# EAGLE design Water Auto Turret Main Board (EAGLE 9.6.2)
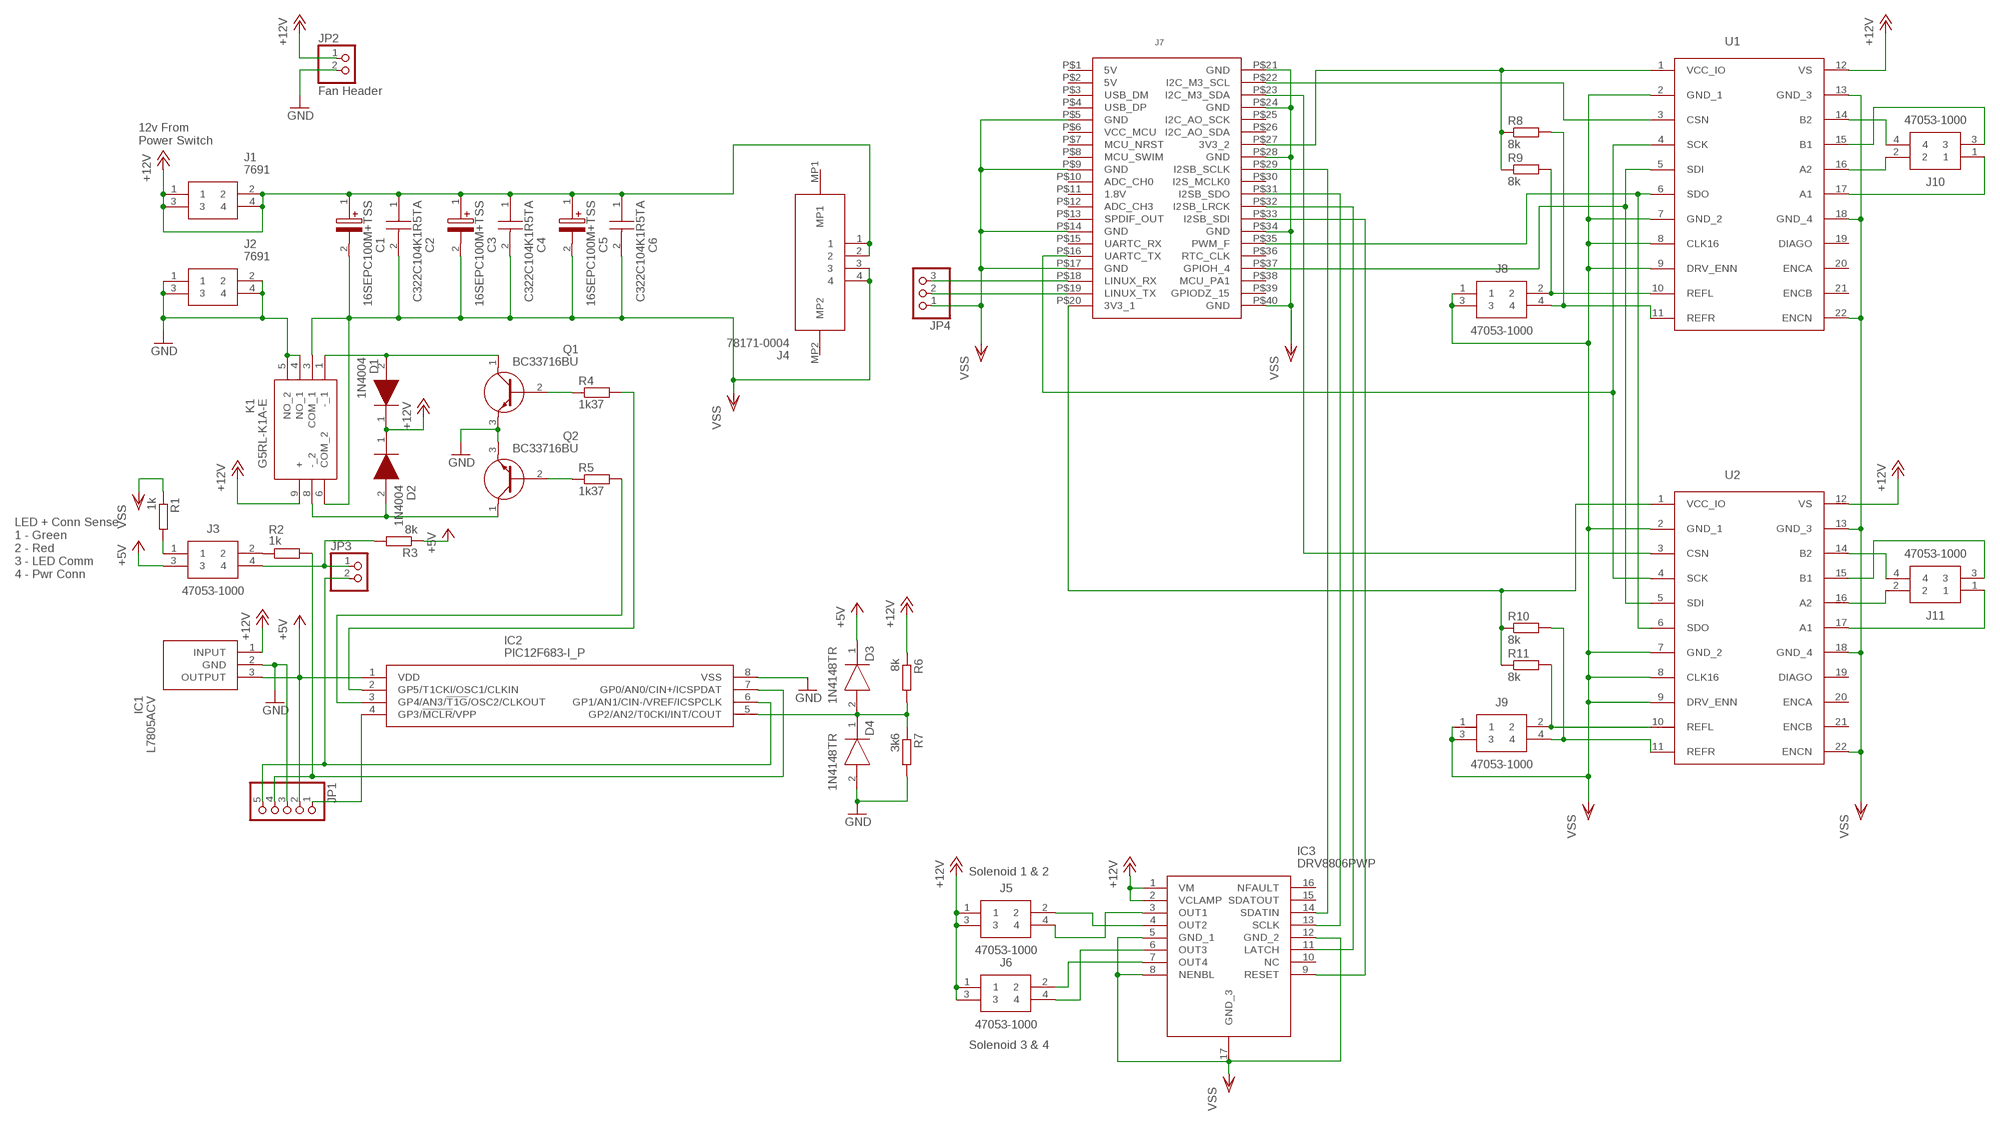
[diagram p0: schematic, sheet 1]

## Parts
C1  16SEPC100M+TSS  [CAPPRD250W45D630H600]
C2  C322C104K1R5TA  [C322C104K1R5TA]
C3  16SEPC100M+TSS  [CAPPRD250W45D630H600]
C4  C322C104K1R5TA  [C322C104K1R5TA]
C5  16SEPC100M+TSS  [CAPPRD250W45D630H600]
C6  C322C104K1R5TA  [C322C104K1R5TA]
D1  1N4004  [DIOAD1408W86L464D236]
D2  1N4004  [DIOAD1408W86L464D236]
D3  1N4148TR  [DIOAD990W55L340D162]
D4  1N4148TR  [DIOAD990W55L340D162]
IC1  L7805ACV  [TO255P460X1020X2008-3P]
IC2  PIC12F683-I_P  PIC12F675-I_P  [DIP781W56P254L950H533Q8N]
IC3  DRV8806PWP  [SOP65P640X120-17N]
J1  7691  [7691]
J2  7691  [7691]
J3  47053-1000  [47053-1000]
J4  78171-0004  [781710004]
J5  47053-1000  [47053-1000]
J6  47053-1000  [47053-1000]
J7  VIM3GPIO  [VIM3GPIO]
J8  47053-1000  [47053-1000]
J9  47053-1000  [47053-1000]
J10  47053-1000  [47053-1000]
J11  47053-1000  [47053-1000]
JP1  PINHD-1X5  [1X05]
JP2  Fan Header  PINHD-1X2  [1X02]
JP3  PINHD-1X2  [1X02]
JP4  PINHD-1X3  [1X03]
K1  G5RL-K1A-E  [G5RLK1AE]
Q1  BC33716BU  [TO-92]
Q2  BC33716BU  [TO-92]
R1  1k  R-EU_V234/12  [V234/12]
R2  1k  R-EU_V234/12  [V234/12]
R3  8k  R-EU_0309/V  [0309V]
R4  1k37  R-EU_V234/12  [V234/12]
R5  1k37  R-EU_V234/12  [V234/12]
R6  8k  R-EU_V234/12  [V234/12]
R7  3k6  R-EU_0309/V  [0309V]
R8  8k  R-EU_V234/12  [V234/12]
R9  8k  R-EU_V234/12  [V234/12]
R10  8k  R-EU_V234/12  [V234/12]
R11  8k  R-EU_V234/12  [V234/12]
U1  TMC5160-BOB  [TMC5160-BOB]
U2  TMC5160-BOB  [TMC5160-BOB]

## Nets
+5V: D3.1(K) IC1.3(OUTPUT) IC2.1(VDD) J3.3 JP1.2 R3.1
+12V: C1.1(+) C2.1 C3.1(+) C4.1 C5.1(+) C6.1 D1.1(K) D2.1(K) IC1.1(INPUT) IC3.1(VM) IC3.2(VCLAMP) J1.1 J1.2 J1.3 J1.4 J4.1 J4.2 J5.1 J5.3 J6.1 J6.3 JP2.1 K1.9(+) R6.1 U1.12(VS) U2.12(VS)
GND: D4.2(A) IC1.2(GND) IC2.8(VSS) J2.1 J2.2 J2.3 J2.4 JP1.3 JP2.2 K1.4(NO_1) K1.5(NO_2) Q1.3(E) Q2.3(E) R7.2
N$1: IC3.4(OUT2) J5.2
N$2: IC3.3(OUT1) J5.4
N$3: IC3.6(OUT3) J6.4
N$4: IC3.7(OUT4) J6.2
N$5: J3.1 R1.2
N$6: D1.2(A) K1.1(-_1) Q1.1(C)
N$7: D2.2(A) K1.8(-_2) Q2.1(C)
N$8: J3.2 R2.1
N$9: IC2.4(GP3/!MCLR!/VPP) JP1.1
N$10: Q1.2(B) R4.1
N$11: IC2.7(GP0/AN0/CIN+/ICSPDAT) JP1.4 R2.2
N$12: IC2.6(GP1/AN1/CIN-/VREF/ICSPCLK) JP1.5 JP3.2
N$13: Q2.2(B) R5.1
N$14: IC2.3(GP4/AN3/!T1G!/OSC2/CLKOUT) R5.2
N$15: IC2.2(GP5/T1CKI/OSC1/CLKIN) R4.2
N$16: D3.2(A) D4.1(K) IC2.5(GP2/AN2/T0CKI/INT/COUT) R6.2 R7.1
N$17: J3.4 JP3.1 R3.2
N$18: J7.P$35(PWM_F) U1.6(SDO) U2.6(SDO)
N$19: J7.P$37(GPIOH_4) U1.5(SDI) U2.5(SDI)
N$20: J7.P$16(UARTC_TX) U1.4(SCK) U2.4(SCK)
N$21: J10.4 U1.14(B2)
N$22: J10.3 U1.15(B1)
N$23: J10.1 U1.17(A1)
N$24: J10.2 U1.16(A2)
N$25: J11.4 U2.14(B2)
N$26: J11.2 U2.16(A2)
N$27: J11.1 U2.17(A1)
N$28: J11.3 U2.15(B1)
N$29: J8.2 R9.2 U1.10(REFL)
N$30: J8.4 R8.2 U1.11(REFR)
N$31: J9.2 R11.2 U2.10(REFL)
N$32: J9.4 R10.2 U2.11(REFR)
N$33: J7.P$20(3V3_1) R10.1 R11.1 U2.1(VCC_IO)
N$35: IC3.14(SDATIN) J7.P$29(I2SB_SCLK)
N$36: IC3.13(SCLK) J7.P$31(I2SB_SDO)
N$37: IC3.11(LATCH) J7.P$32(I2SB_LRCK)
N$38: IC3.9(RESET) J7.P$33(I2SB_SDI)
N$39: J7.P$18(LINUX_RX) JP4.3
N$40: J7.P$19(LINUX_TX) JP4.2
N$42: J7.P$27(3V3_2) R8.1 R9.1 U1.1(VCC_IO)
N$44: J7.P$22(I2C_M3_SCL) U1.3(CSN)
N$45: J7.P$23(I2C_M3_SDA) U2.3(CSN)
VSS: C1.2(-) C2.2 C3.2(-) C4.2 C5.2(-) C6.2 IC3.5(GND_1) IC3.8(NENBL) IC3.12(GND_2) IC3.17(GND_3) J4.3 J4.4 J7.P$5(GND) J7.P$9(GND) J7.P$14(GND) J7.P$17(GND) J7.P$21(GND) J7.P$24(GND) J7.P$28(GND) J7.P$34(GND) J7.P$40(GND) J8.1 J8.3 J9.1 J9.3 JP4.1 K1.3(COM_1) K1.6(COM_2) R1.1 U1.2(GND_1) U1.7(GND_2) U1.8(CLK16) U1.9(DRV_ENN) U1.13(GND_3) U1.18(GND_4) U1.22(ENCN) U2.2(GND_1) U2.7(GND_2) U2.8(CLK16) U2.9(DRV_ENN) U2.13(GND_3) U2.18(GND_4) U2.22(ENCN)
Unconnected: IC3.10(NC) IC3.15(SDATOUT) IC3.16(NFAULT) J4.MP1 J4.MP2 J7.P$3(USB_DM) J7.P$4(USB_DP) J7.P$6(VCC_MCU) J7.P$7(MCU_NRST) J7.P$8(MCU_SWIM) J7.P$10(ADC_CH0) J7.P$11(1.8V) J7.P$12(ADC_CH3) J7.P$13(SPDIF_OUT) J7.P$15(UARTC_RX) J7.P$25(I2C_AO_SCK) J7.P$26(I2C_AO_SDA) J7.P$30(I2S_MCLK0) J7.P$36(RTC_CLK) J7.P$38(MCU_PA1) J7.P$39(GPIODZ_15) U1.19(DIAGO) U1.20(ENCA) U1.21(ENCB) U2.19(DIAGO) U2.20(ENCA) U2.21(ENCB)

## Notes on the sheet
- 12v From
  Power Switch
- LED + Conn Sense
  1 - Green
  2 - Red
  3 - LED Comm
  4 - Pwr Conn
- Solenoid 1 & 2
- Solenoid 3 & 4

## Power pins joined to a net without a drawn wire
5V: J7.P$1(5V) J7.P$2(5V)

## Library data of the parts
C1 C3 C5 = SamacSys_Parts:16SEPC100M+TSS: Panasonic Aluminium Electrolytic Capacitor 150uF 16V dc 6.3mm Through Hole C6 OSCON SEP Series +105C Source: Datasheet <https://industrial.panasonic.com/cdbs/www-data/pdf/AAB8000/AAB8000C247.pdf>; ARROW_PART_NUMBER: 16SEPC100M+TSS; ARROW_PRICE-STOCK: https://www.arrow.com/en/products/16sepc100mtss/panasonic; DESCRIPTION: Panasonic Aluminium Electrolytic Capacitor 150uF 16V dc 6.3mm Through Hole C6 OSCON SEP Series +105C; HEIGHT: 6mm; MANUFACTURER_NAME: Panasonic; MANUFACTURER_PART_NUMBER: 16SEPC100M+TSS; MOUSER_PART_NUMBER: 667-16SEPC100M+TSS; MOUSER_PRICE-STOCK: https://www.mouser.co.uk/ProductDetail/Panasonic/16SEPC100M%2bTSS?qs=OE1iw1LrrPEAt2lEmEitdA%3D%3D
C2 C4 C6 = SamacSys_Parts:C322C104K1R5TA: Radial X7R ceramic cap,100nF 100V 5mm Kemet Radial C 100nF Ceramic Multilayer Capacitor, 100 V dc, +125C, X7R Dielectric, +/-10% Source: Datasheet <http://uk.rs-online.com/webdocs/1517/0900766b815170e8.pdf>; ARROW_PART_NUMBER: C322C104K1R5TA; ARROW_PRICE-STOCK: https://www.arrow.com/en/products/c322c104k1r5ta/kemet-corporation; DESCRIPTION: Radial X7R ceramic cap,100nF 100V 5mm Kemet Radial C 100nF Ceramic Multilayer Capacitor, 100 V dc, +125C, X7R Dielectric, +/-10%; HEIGHT: mm; MANUFACTURER_NAME: Kemet; MANUFACTURER_PART_NUMBER: C322C104K1R5TA; MOUSER_PART_NUMBER: 80-C322C104K1R; MOUSER_PRICE-STOCK: https://www.mouser.co.uk/ProductDetail/KEMET/C322C104K1R5TA?qs=bj9urr5MP%2FL1an4soHFd0Q%3D%3D
D1 D2 = SamacSys_Parts:1N4004: MULTICOMP - 1N4004 - DIODE, STANDARD, 1A, 400V,DO-41 Source: Datasheet <http://www.farnell.com/datasheets/639187.pdf?_ga=2.125608974.548563645.1516631449-782537906.1516376607>; DESCRIPTION: MULTICOMP - 1N4004 - DIODE, STANDARD, 1A, 400V,DO-41; HEIGHT: mm; MANUFACTURER_NAME: MULTICOMP; MANUFACTURER_PART_NUMBER: 1N4004
D3 D4 = SamacSys_Parts:1N4148TR: DIODE, SMALL SIGNAL, 100V, 450MA, DO-35 PKG Source: Datasheet <https://www.vishay.com/docs/81857/1n4148.pdf>; ARROW_PART_NUMBER: 1N4148TR; ARROW_PRICE-STOCK: https://www.arrow.com/en/products/1n4148tr/vishay; DESCRIPTION: DIODE, SMALL SIGNAL, 100V, 450MA, DO-35 PKG; HEIGHT: mm; MANUFACTURER_NAME: Vishay; MANUFACTURER_PART_NUMBER: 1N4148TR; MOUSER_PART_NUMBER: 78-1N4148; MOUSER_PRICE-STOCK: https://www.mouser.co.uk/ProductDetail/Vishay-Semiconductors/1N4148TR?qs=HfDODkYFUverVKi%2FJ%2Fe5IA%3D%3D
IC1 = SamacSys_Parts:L7805ACV: Linear voltage regulator,L7805ACV 5V 1A STMicroelectronics L7805ACV, Single Linear Voltage Regulator, 1A 5 V, 2%, 3-Pin TO-220 Source: Datasheet <http://www.st.com/web/en/resource/technical/document/datasheet/CD00000444.pdf>; ARROW_PART_NUMBER: L7805ACV; ARROW_PRICE-STOCK: https://www.arrow.com/en/products/l7805acv/stmicroelectronics; DESCRIPTION: Linear voltage regulator,L7805ACV 5V 1A STMicroelectronics L7805ACV, Single Linear Voltage Regulator, 1A 5 V, 2%, 3-Pin TO-220; HEIGHT: 4.6mm; MANUFACTURER_NAME: STMicroelectronics; MANUFACTURER_PART_NUMBER: L7805ACV; MOUSER_PART_NUMBER: 511-L7805ACV; MOUSER_PRICE-STOCK: https://www.mouser.co.uk/ProductDetail/STMicroelectronics/L7805ACV?qs=xv3lWMc77RdYd2PeLwOwYw%3D%3D
IC2 = SamacSys_Parts:PIC12F675-I_P: MICROCHIP - PIC12F675-I/P - MCU, 8BIT, PIC12, 20MHZ, DIP-8 Source: Datasheet <http://docs-emea.rs-online.com/webdocs/139d/0900766b8139dee5.pdf>; ARROW_PART_NUMBER: PIC12F675-I/P; ARROW_PRICE-STOCK: https://www.arrow.com/en/products/pic12f675-ip/microchip-technology; DESCRIPTION: MICROCHIP - PIC12F675-I/P - MCU, 8BIT, PIC12, 20MHZ, DIP-8; HEIGHT: 5.334mm; MANUFACTURER_NAME: Microchip; MANUFACTURER_PART_NUMBER: PIC12F675-I/P; MOUSER_PART_NUMBER: 579-PIC12F675-I/P; MOUSER_PRICE-STOCK: https://www.mouser.co.uk/ProductDetail/Microchip-Technology/PIC12F675-I-P/?qs=g6BBfX6YTklkFbwYwZUX2A%3D%3D
IC3 = SamacSys_Parts:DRV8806PWP: Texas Instruments DRV8806PWP Motor Driver,, 16-Pin HTSSOP Source: Datasheet <http://www.ti.com/lit/ds/symlink/drv8806.pdf>; ARROW_PART_NUMBER: DRV8806PWP; ARROW_PRICE-STOCK: https://www.arrow.com/en/products/drv8806pwp/texas-instruments; DESCRIPTION: Texas Instruments DRV8806PWP Motor Driver,, 16-Pin HTSSOP; HEIGHT: 1.2mm; MANUFACTURER_NAME: Texas Instruments; MANUFACTURER_PART_NUMBER: DRV8806PWP; MOUSER_PART_NUMBER: 595-DRV8806PWP; MOUSER_PRICE-STOCK: https://www.mouser.co.uk/ProductDetail/Texas-Instruments/DRV8806PWP?qs=y0LsnOHuQQ7HGd2Xojxt6A%3D%3D
J1 J2 = SamacSys_Parts-old:7691: Terminals VERT SCREW TERM MATTE TINNED Source: Datasheet <https://www.mouser.com/ds/2/215/691-741193.pdf>; DESCRIPTION: Terminals VERT SCREW TERM MATTE TINNED; HEIGHT: 6mm; MANUFACTURER_NAME: Keystone Electronics; MANUFACTURER_PART_NUMBER: 7691; RS_PART_NUMBER: 4096566; RS_PRICE/STOCK: http://uk.rs-online.com/web/p/products/4096566
J3 J6 J8-J11 = SamacSys_Parts-old:47053-1000: MOLEX - 47053-1000 - HEADER, 4POS, 1ROW, 2.54MM <https://componentsearchengine.com/Images/1/47053-1000.jpg> Source: Datasheet <http://www.molex.com/pdm_docs/sd/470531000_sd.pdf>; ALLIED_NUMBER: 70364007; DESCRIPTION: MOLEX - 47053-1000 - HEADER, 4POS, 1ROW, 2.54MM; HEIGHT: mm; MANUFACTURER_NAME: Molex; MANUFACTURER_PART_NUMBER: 47053-1000; SUPPLIER_NAME: RS
J4 = SamacSys_Parts:78171-0004: Molex PICO-EZMATE 78171, 1.2mm Pitch, 4 Way, 1 Row, Straight PCB Header, Surface Mount Source: Datasheet <https://www.molex.com/pdm_docs/sd/781710004_sd.pdf>; DESCRIPTION: Molex PICO-EZMATE 78171, 1.2mm Pitch, 4 Way, 1 Row, Straight PCB Header, Surface Mount; HEIGHT: 1.6mm; MANUFACTURER_NAME: Molex; MANUFACTURER_PART_NUMBER: 78171-0004; MOUSER_PART_NUMBER: 538-78171-0004; MOUSER_PRICE-STOCK: https://www.mouser.co.uk/ProductDetail/Molex/78171-0004?qs=rg3U%2F5nEhHfTM3gyKulQEQ%3D%3D
J5 = SamacSys_Parts-old:47053-1000: MOLEX - 47053-1000 - HEADER, 4POS, 1ROW, 2.54MM <https://componentsearchengine.com/Images/1/47053-1000.jpg> Source: Datasheet <http://www.molex.com/pdm_docs/sd/470531000_sd.pdf>; ALLIED_NUMBER: 70364007; DESCRIPTION: MOLEX - 47053-1000 - HEADER, 4POS, 1ROW, 2.54MM; HEIGHT: mm; MANUFACTURER_NAME: Molex; MANUFACTURER_PART_NUMBER: Solenoid 1 & 2; SUPPLIER_NAME: RS
J7 = VIM3GPIO:VIM3GPIO
JP1 = pinhead:PINHD-1X5: PIN HEADER
JP2 JP3 = pinhead:PINHD-1X2: PIN HEADER
JP4 = pinhead:PINHD-1X3: PIN HEADER
K1 = SamacSys_Parts:G5RL-K1A-E: General Purpose Relays 16A hi swtch curent latching relay Source: Datasheet <https://omronfs.omron.com/en_US/ecb/products/pdf/en-g5rl_uk.pdf>; DESCRIPTION: General Purpose Relays 16A hi swtch curent latching relay; HEIGHT: mm; MANUFACTURER_NAME: Omron Electronics; MANUFACTURER_PART_NUMBER: G5RL-K1A-E
Q1 Q2 = SamacSys_Parts:BC33716BU: Transistor NPN 45V 0.8A hfe100 TO92 Fairchild BC33716BU NPN Bipolar Transistor, 0.8 A, 45 V, 3-Pin TO-92 Source: Datasheet <https://componentsearchengine.com/Datasheets/2/BC33716BU.pdf>; ARROW_PART_NUMBER: BC33716BU; ARROW_PRICE-STOCK: https://www.arrow.com/en/products/bc33716bu/on-semiconductor; DESCRIPTION: Transistor NPN 45V 0.8A hfe100 TO92 Fairchild BC33716BU NPN Bipolar Transistor, 0.8 A, 45 V, 3-Pin TO-92; HEIGHT: mm; MANUFACTURER_NAME: ON Semiconductor; MANUFACTURER_PART_NUMBER: BC33716BU; MOUSER_PART_NUMBER: 512-BC33716BU; MOUSER_PRICE-STOCK: https://www.mouser.co.uk/ProductDetail/ON-Semiconductor-Fairchild/BC33716BU?qs=D3DIWr27d5tE21OxgzsorQ%3D%3D
R1-R11 = resistor:R-EU_: RESISTOR, European symbol
U1 U2 = TMC5160-BOB:TMC5160-BOB

## Board
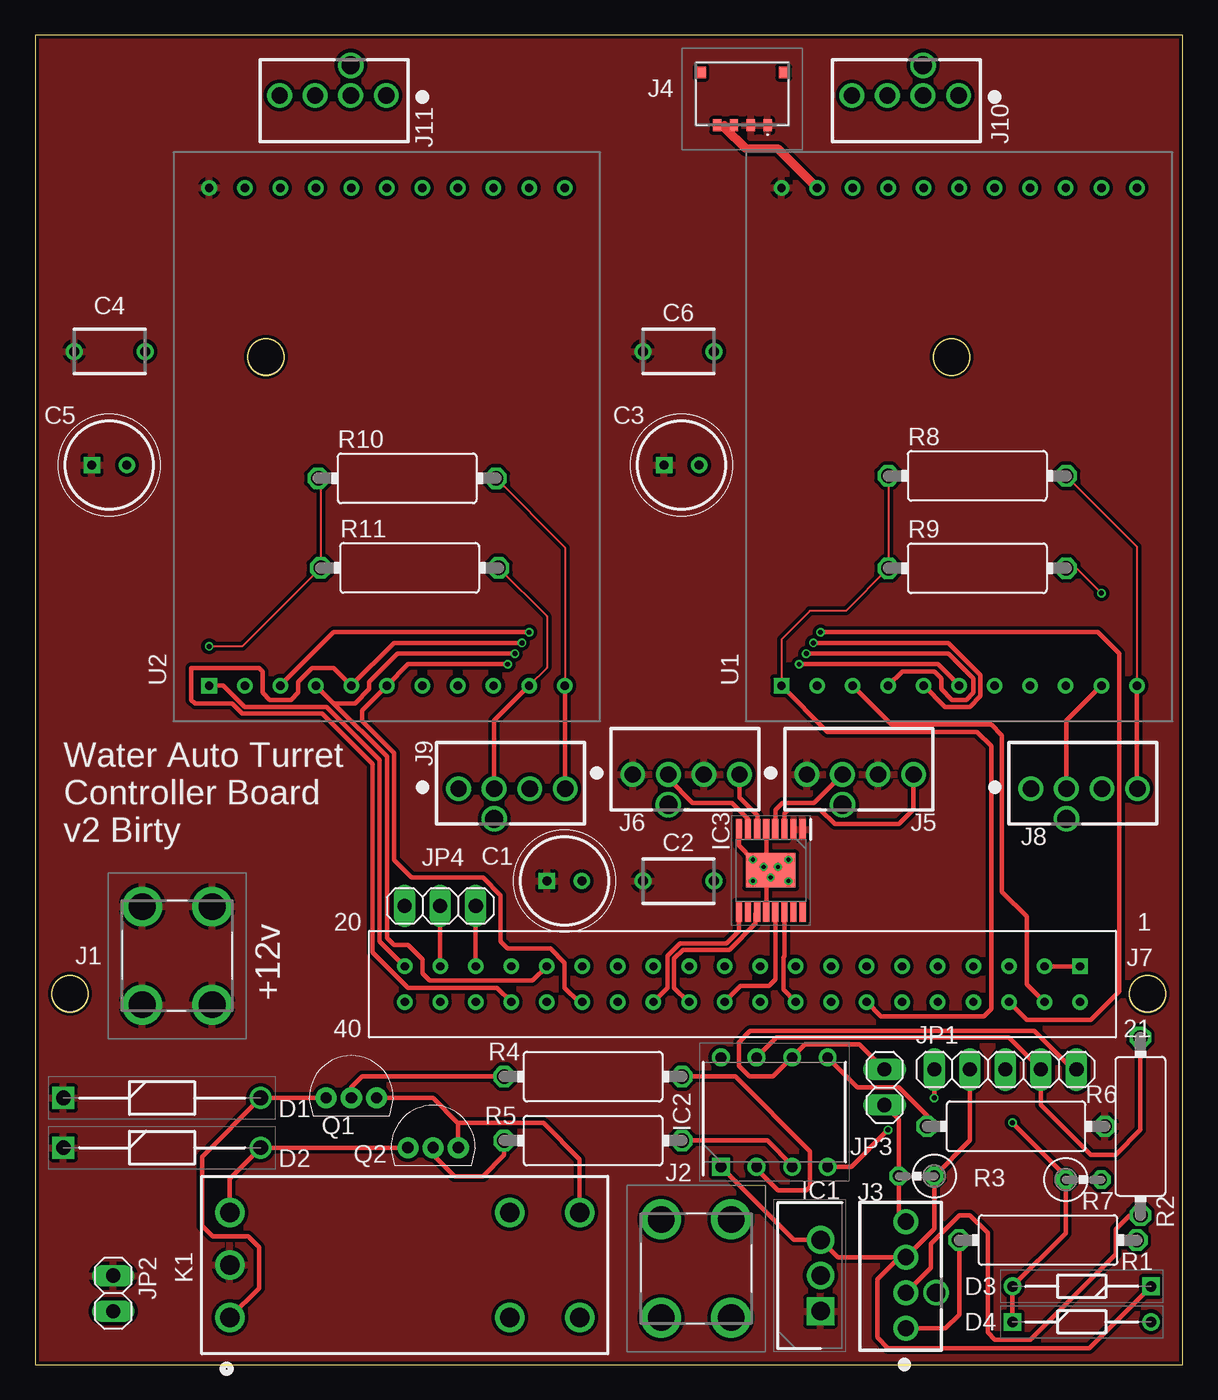
[diagram p1: board, top side]
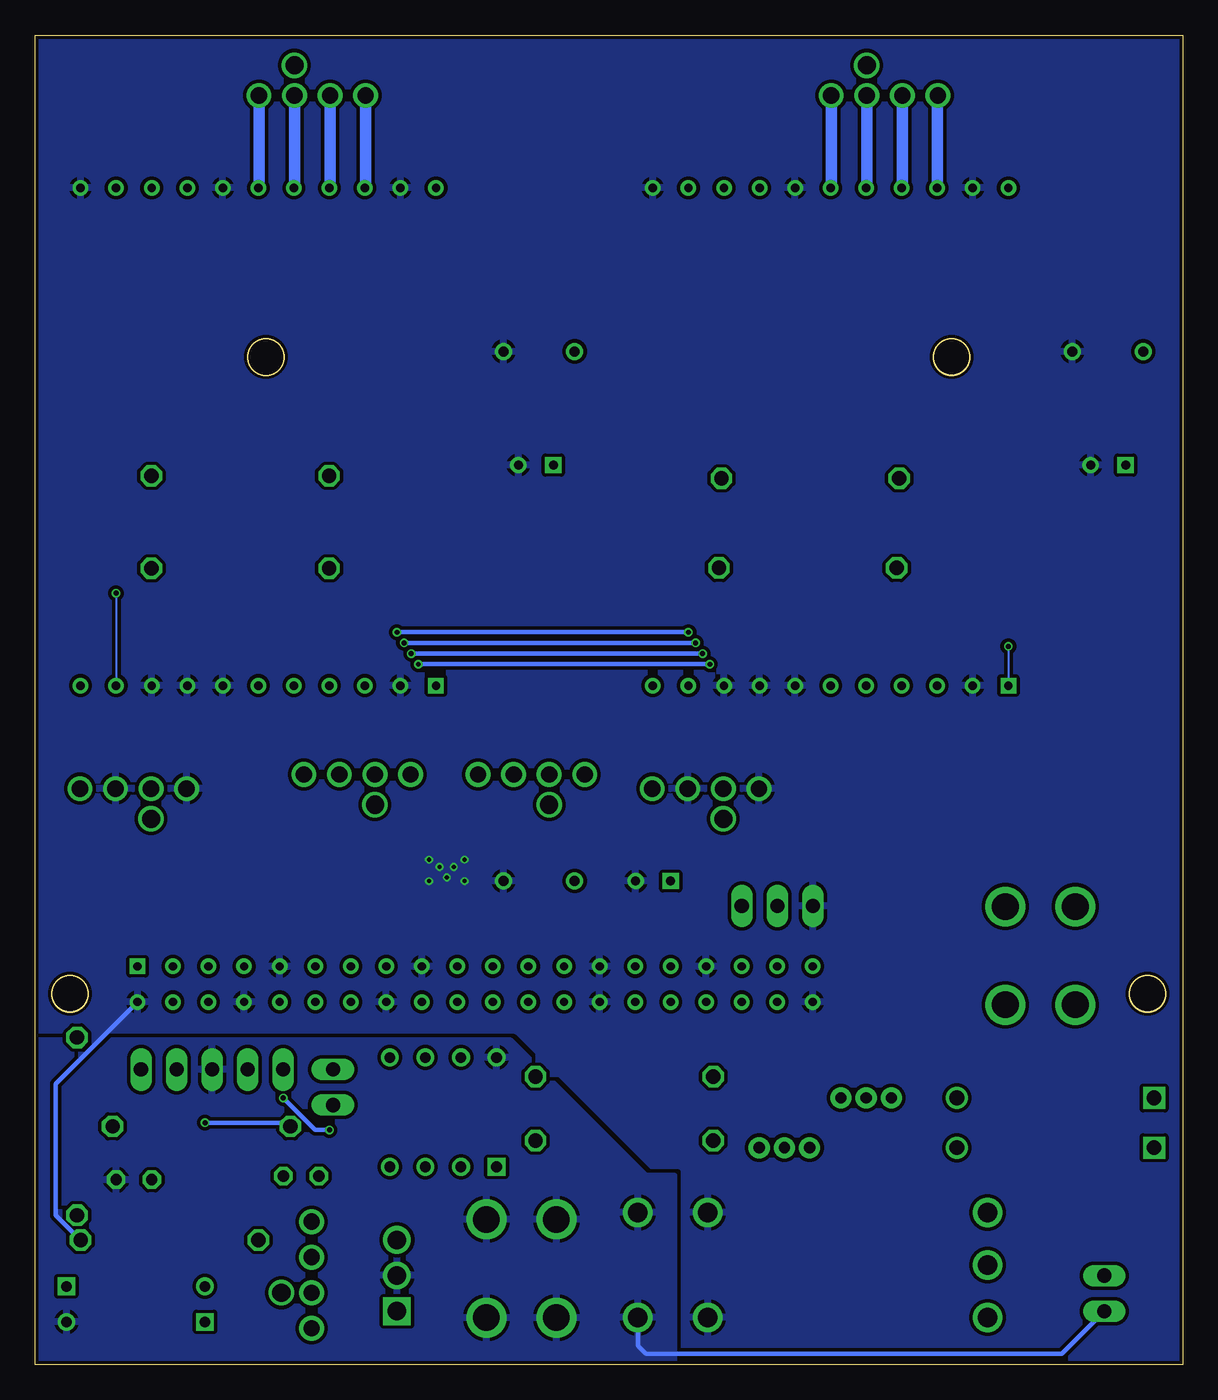
[diagram p2: board, bottom side, seen from below]

Size 82 x 95 mm. Coordinates in mm from the lower left corner, seen from the top.
Outline: 0,95 0,0 82,0 82,95 0,95
Outline: circle at 16.5,71.99 radius 1.3
Outline: circle at 2.5,26.49 radius 1.3
Outline: circle at 65.5,71.99 radius 1.3
Outline: circle at 79.5,26.49 radius 1.3
Copper layers (1*16): Top 0.035mm / dielectric 1.6mm / Bottom 0.035mm
Design rules "jlcpcb-2layers *": minimum track width 5mil, minimum drill 0.3mm, track to track 5mil, track to pad 5mil, pad to pad 5mil, via to via 5mil, smd to smd 5mil, copper to edge 0.2mm, drill to drill 6mil, minimum pad ring 10mil, minimum via ring 5mil, stop-mask expansion 4mil, vias tented up to drill 0mil, thermal gap 10mil
Holes 2.6 mm at 2.5,26.5 79.5,26.5 65.5,71.99 16.5,72

### Footprints (pad centres in the part's own frame; a part is rotated, then mirrored left to right if it is on the bottom)
CAPPRD250W45D630H600 = drill 0.65 pad 1.05 square: 1 0,0 | drill 0.65 pad 1.05: 2 2.5,0
C322C104K1R5TA = drill 0.71 pad 1.21: 1 -2.54,0; 2 2.54,0
DIOAD1408W86L464D236 = drill 1.05 pad 1.575 square: 1 0,0 | drill 1.05 pad 1.575: 2 14.1,0
DIOAD990W55L340D162 = drill 0.75 pad 1.15 square: 1 0,0 | drill 0.75 pad 1.15: 2 9.9,0
TO255P460X1020X2008-3P = drill 1.32 pad 1.98 square: 1 0,0 | drill 1.32 pad 1.98: 2 2.55,0; 3 5.1,0
DIP781W56P254L950H533Q8N = drill 0.759 pad 1.159 square: 1 -3.905,3.81 | drill 0.759 pad 1.159: 2 -3.905,1.27; 3 -3.905,-1.27; 4 -3.905,-3.81; 5 3.905,-3.81; 6 3.905,-1.27; 7 3.905,1.27; 8 3.905,3.81
SOP65P640X120-17N = smd 1.475 x 0.45: 1 -2.938,2.275; 2 -2.938,1.625; 3 -2.938,0.975; 4 -2.938,0.325; 5 -2.938,-0.325; 6 -2.938,-0.975; 7 -2.938,-1.625; 8 -2.938,-2.275; 9 2.938,-2.275; 10 2.938,-1.625; 11 2.938,-0.975; 12 2.938,-0.325; 13 2.938,0.325; 14 2.938,0.975; 15 2.938,1.625; 16 2.938,2.275 | smd 2.46 x 3.55: 17 0,0
7691 = drill 1.9 pad 2.85: 1 -2.5,3.505; 2 2.5,3.505; 3 2.5,-3.505; 4 -2.5,-3.505
47053-1000 = drill 1.17 pad 1.77: 1 1.57,2.54; 2 4.11,2.54; 3 6.65,2.54; 4 9.19,2.54 | drill 1.3 pad 1.3: 5 4.11,0.38
781710004 = smd 0.6 x 0.85: 1 -1.8,1.875; 2 -0.6,1.875; 3 0.6,1.875; 4 1.8,1.875 | smd 0.7 x 0.8: MP1 -2.95,-1.9; MP2 2.95,-1.9
VIM3GPIO = drill 0.6 square: P$1 0,0 | drill 0.6: P$2 -2.54,0; P$3 -5.08,0; P$4 -7.62,0; P$5 -10.16,0; P$6 -12.7,0; P$7 -15.24,0; P$8 -17.78,0; P$9 -20.32,0; P$10 -22.86,0; P$11 -25.4,0; P$12 -27.94,0; P$13 -30.48,0; P$14 -33.02,0; P$15 -35.56,0; P$16 -38.1,0; P$17 -40.64,0; P$18 -43.18,0; P$19 -45.72,0; P$20 -48.26,0; P$21 0,-2.54; P$22 -2.54,-2.54; P$23 -5.08,-2.54; P$24 -7.62,-2.54; P$25 -10.16,-2.54; P$26 -12.7,-2.54; P$27 -15.24,-2.54; P$28 -17.78,-2.54; P$29 -20.32,-2.54; P$30 -22.86,-2.54; P$31 -25.4,-2.54; P$32 -27.94,-2.54; P$33 -30.48,-2.54; P$34 -33.02,-2.54; P$35 -35.56,-2.54; P$36 -38.1,-2.54; P$37 -40.64,-2.54; P$38 -43.18,-2.54; P$39 -45.72,-2.54; P$40 -48.26,-2.54
1X05 = drill 1.016 long: 1 -5.08,0; 2 -2.54,0; 3 0,0; 4 2.54,0; 5 5.08,0
1X02 = drill 1.016 long: 1 -1.27,0; 2 1.27,0
1X03 = drill 1.016 long: 1 -2.54,0; 2 0,0; 3 2.54,0
G5RLK1AE = drill 1.4 pad 2.1: 1 -12.5,-3.75; 3 7.5,-3.75; 4 12.5,-3.75; 5 12.5,3.75; 6 7.5,3.75; 8 -12.5,3.75; 9 -12.5,0
TO-92 = drill 0.81 pad 1.51: 1 0,-1.8; 2 0,0; 3 0,1.8
V234/12 = drill 1.016 octagon: 1 -6.35,0; 2 6.35,0
0309V = drill 0.813 octagon: 1 -1.27,0; 2 1.27,0
TMC5160-BOB = drill 0.6 square: 1 0,0 | drill 0.6: 2 0,-2.54; 3 0,-5.08; 4 0,-7.62; 5 0,-10.16; 6 0,-12.7; 7 0,-15.24; 8 0,-17.78; 9 0,-20.32; 10 0,-22.86; 11 0,-25.4; 12 35.56,0; 13 35.56,-2.54; 14 35.56,-5.08; 15 35.56,-7.62; 16 35.56,-10.16; 17 35.56,-12.7; 18 35.56,-15.24; 19 35.56,-17.78; 20 35.56,-20.32; 21 35.56,-22.86; 22 35.56,-25.4

### Placement (x,y rotation side)
C1  36.58,34.54 0 top
C2  45.97,34.54 0 top
C3  44.96,64.26 0 top
C4  5.33,72.39 0 top
C5  4.06,64.26 0 top
C6  45.97,72.39 0 top
D1  2.03,19.05 0 top
D2  2.03,15.49 0 top
D3  79.76,5.59 180 top
D4  69.85,3.05 0 top
IC1  56.13,3.81 90 top
IC2  52.83,18.03 90 top
IC3  52.58,35.31 270 top
J1  10.16,29.21 0 top
J2  47.24,6.86 0 top
J3  64.77,1.02 90 top
J4  50.55,90.42 180 top
J5  53.59,39.62 0 top
J6  41.15,39.62 0 top
J7  74.68,28.45 0 top
J8  69.6,38.61 0 top
J9  28.7,38.61 0 top
J10  67.56,93.22 180 top
J11  26.67,93.22 180 top
JP1  69.34,21.08 0 top
JP2  5.59,5.08 270 top
JP3  60.71,19.81 90 top
JP4  28.96,32.77 0 top
K1  26.42,7.11 0 top
Q1  22.61,19.05 270 top
Q2  28.45,15.49 270 top
R1  72.39,8.89 180 top
R2  78.99,17.02 90 top
R3  62.99,13.46 180 top
R4  39.88,20.57 0 top
R5  39.88,16 0 top
R6  70.1,17.02 180 top
R7  74.93,13.21 0 top
R8  67.34,63.5 0 top
R9  67.34,56.9 0 top
R10  26.59,63.32 0 top
R11  26.77,56.92 0 top
U1  53.34,48.51 90 top
U2  12.45,48.51 90 top

### Tracks (layer width: path | path; a pad name or v marks a point on that pad's centre or on a via)
5V
  Top 0.305: J7.P$2 J7.P$1
+5V
  Top 0.305: IC2.1 54.24,8.91 IC1.3 57.38,7.67 J3.3 | D3.1 75.34,1.17 60.96,1.17 60.2,1.93 60.2,6.1 61.77,7.67 J3.3 | J3.3 64.26,9.7 R3.1 66.8,16 JP1.2
+12V
  pour Top (isolate 0.254): -0.25,95 81.79,95 82.04,95.25 82.04,-0.25 0,-0.25 -0.25,0
GND
  Top 0.305: Q2.3 30.25,17.25 | 30.25,17.25 28.45,19.05 Q1.3 | K1.5 38.92,14.68 36.32,17.27 30.27,17.27 30.25,17.25
  Bottom 0.305: JP2.2 8.64,0.76 38.35,0.76 38.92,1.32 K1.4
  pour Bottom (isolate 0.254): 82.04,0 36.32,0 36.32,13.46 38.35,13.46 48.01,23.11 82.04,23.11
N$1
  Top 0.305: IC3.4 52.9,39.62 53.41,40.13 55.67,40.13 J5.2
N$2
  Top 0.305: IC3.3 53.55,39.36 53.81,39.62 56.13,39.62 57.15,38.61 61.72,38.61 62.78,39.67 J5.4
N$3
  Top 0.305: IC3.6 51.61,39.23 50.34,40.51 J6.4
N$4
  Top 0.305: IC3.7 50.96,38.98 49.81,40.13 46.99,40.13 45.26,41.86 J6.2
N$5
  Top 0.305: J3.1 65.07,2.59 66.04,3.56 R1.2
N$6
  Top 0.305: Q1.1 D1.2 11.94,14.86 11.94,9.91 12.7,9.14 15.24,9.14 16,8.38 16,5.45 K1.1
N$7
  Top 0.305: K1.8 13.92,13.28 D2.2 Q2.1
N$8
  Top 0.305: J3.2 64.01,6.9 64.01,8.64 66.04,10.67 66.8,10.67 68.07,9.4 68.07,2.29 68.58,1.78 71.12,1.78 77.22,7.87 77.22,9.65 78.23,10.67 R2.1
N$9  (via drill 0.35)
  Top 0.305: JP1.1 v64.26,19.05 | IC2.4 58.33,14.13 v60.96,16.76
  Bottom 0.305: v64.26,19.05 61.98,16.76 v60.96,16.76
N$10
  Top 0.305: R4.1 23.37,20.57 22.61,19.81 Q1.2
N$11
  Top 0.305: R2.2 78.99,16.76 77.22,14.99 75.44,14.99 71.88,18.54 JP1.4 69.6,23.37 52.99,23.37 IC2.7
N$12
  Top 0.305: JP3.2 58.93,22.86 55.02,22.86 IC2.6 52.74,20.57 51.05,20.57 50.29,21.34 50.29,23.01 51.1,23.82 71.41,23.82 74.15,21.08 JP1.5
N$13
  Top 0.305: R5.1 33.53,14.99 32,13.46 29.97,13.46 28.45,14.99 Q2.2
N$14
  Top 0.305: R5.2 52.32,16 54.1,14.22 IC2.3
N$15
  Top 0.305: R4.2 50.04,20.57 55.37,15.24 55.37,12.7 55.12,12.45 53.09,12.45 51.56,13.97 IC2.2
N$16  (via drill 0.35)
  Top 0.305: D4.1 D3.2 73.66,9.39 R7.1 73.66,13.46 v69.85,17.27 | R6.2 63.75,17.78 61.72,19.81 58.77,19.81 IC2.5
  Bottom 0.305: R6.2 64.01,17.27 v69.85,17.27
N$17
  Top 0.305: J3.4 61.72,10.71 R3.2 61.72,17.53 JP3.1
N$18  (via drill 0.35)
  Top 0.305: U1.6 64.52,50.04 v54.61,50.04 | v33.78,50.04 26.67,50.04 U2.6 23.37,46.74 23.37,45.97 25.65,43.69 25.65,36.07 26.92,34.8 32,34.8 33.27,33.53 33.27,30.23 33.78,29.72 36.83,29.72 37.85,28.7 37.85,26.92 38.86,25.91 J7.P$35
  Bottom 0.305: v33.78,50.04 v54.61,50.04
N$19  (via drill 0.35)
  Top 0.305: U1.5 65.02,46.99 66.8,46.99 67.56,47.75 67.56,49.28 65.28,51.56 v55.63,51.56 | v34.8,51.56 25.65,51.56 U2.5 21.34,49.78 19.81,49.78 18.8,48.77 18.8,48.01 18.29,47.5 16.76,47.5 16.26,48.01 16.26,49.53 16,49.78 11.18,49.78 11.18,47.5 11.43,47.24 14.09,47.24 14.8,46.53 20.52,46.53 24.13,42.93 24.13,29.46 26.67,26.92 33.02,26.92 J7.P$37
  Bottom 0.305: v34.8,51.56 v55.63,51.56
N$20  (via drill 0.35)
  Top 0.305: 21.34,47.24 25.15,43.43 25.15,30.48 25.65,29.97 26.67,29.97 27.69,28.96 27.69,27.94 28.19,27.43 35.56,27.43 J7.P$16 | U2.4 21.34,47.24 | 21.34,47.24 22.86,47.24 23.88,48.26 23.88,48.77 25.91,50.8 v34.29,50.8 | U1.4 61.98,49.53 64.26,49.53 64.77,49.02 64.77,48.26 65.53,47.5 66.55,47.5 67.06,48.01 67.06,49.02 65.28,50.8 v55.12,50.8
  Bottom 0.305: v34.29,50.8 v55.12,50.8
N$21
  Bottom 0.813: J10.4 58.37,84.12 U1.14
N$22
  Bottom 0.813: J10.3 60.91,84.12 U1.15
N$23
  Bottom 0.813: J10.1 65.99,84.12 U1.17
N$24
  Bottom 0.813: J10.2 63.45,84.12 U1.16
N$25
  Bottom 0.813: J11.4 17.53,90.63 U2.14
N$26
  Bottom 0.813: J11.2 22.56,84.12 U2.16
N$27
  Bottom 0.813: J11.1 25.1,84.12 U2.17
N$28
  Bottom 0.813: J11.3 20.02,84.12 U2.15
N$29  (via drill 0.35)
  Top 0.152: R9.2 74.42,56.9 v76.2,55.12
  Top 0.305: J8.2 73.71,46.02 U1.10
  Bottom 0.152: v76.2,55.12 U1.10
N$30
  Top 0.152: R8.2 78.74,58.45 U1.11
  Top 0.305: U1.11 78.74,41.19 J8.4
N$31
  Top 0.152: R11.2 36.58,53.47 36.58,49.78 U2.10
  Top 0.305: J9.2 32.81,46.02 U2.10
N$32
  Top 0.152: R10.2 37.89,58.37 37.89,48.47
  Top 0.305: J9.4 37.89,48.47 U2.11
N$33  (via drill 0.35)
  Top 0.152: R10.1 20.42,63.14 R11.1 14.81,51.31 v12.45,51.31
  Top 0.305: J7.P$20 24.64,30.23 24.64,43.18 20.83,46.99 14.99,46.99 13.46,48.51 U2.1
  Bottom 0.152: v12.45,51.31 U2.1
N$35
  Top 0.305: IC3.14 53.55,29.17 53.47,29.08 53.47,26.8 J7.P$29
N$36
  Top 0.305: IC3.13 52.9,27.5 52.45,27.05 50.42,27.05 J7.P$31
N$37
  Top 0.305: IC3.11 51.48,32.25 51.48,31.5 49.62,29.64 46.29,29.64 45.67,29.02 45.67,26.92 46.69,25.91 J7.P$32
N$38
  Top 0.305: IC3.9 50.29,32.36 50.29,30.99 49.4,30.1 46.1,30.1 45.21,29.21 45.21,26.92 J7.P$33
N$39
  Top 0.305: J7.P$18 JP4.3
N$40
  Top 0.305: J7.P$19 JP4.2
N$42
  Top 0.152: R8.1 R9.1 57.94,53.85 55.37,53.85 53.34,51.82 U1.1
  Top 0.305: J7.P$27 60.45,24.89 67.82,24.89 68.33,25.4 68.33,44.2 67.31,45.21 56.64,45.21 U1.1
N$44
  Top 0.305: U1.3 61.21,45.72 68.33,45.72 69.09,44.96 69.09,33.78 70.87,32 70.87,27.18 J7.P$22
N$45  (via drill 0.35)
  Top 0.305: U2.3 21.34,52.32 v35.31,52.32 | v56.13,52.32 75.95,52.32 77.47,50.8 77.47,34.8 77.47,34.54 77.47,26.67 75.44,24.64 70.87,24.64 J7.P$23
  Bottom 0.305: v35.31,52.32 v56.13,52.32
VSS  (via drill 0.3)
  Top 0.305: J4.3 49.28,88.55 J4.4 | IC3.12 52.25,34.98 52.45,35.18 | 52.45,35.18 IC3.17 v52.58,34.8 | IC3.5 52.25,35.38 52.45,35.18 | IC3.8 50.3,37.07 v51.31,36.07
  Top 0.61: U1.13 53.09,86.87 50.8,86.87 49.28,88.39 49.28,88.55
  Bottom 0.305: R1.1 80.52,10.67 80.52,20.07 J7.P$21
  other vias: 51.31,34.54 53.85,34.54 53.85,36.07 52.07,35.56 53.09,35.56
  pour Bottom (isolate 0.254, rank 2): 82.04,0 12.45,-0.51 -0.25,-0.51 -0.25,94.74 0,95 81.79,95 82.55,94.23 82.55,0.51

### Text on the board
tNames: Water Auto Turret / Controller Board / v2 Birty | +12v